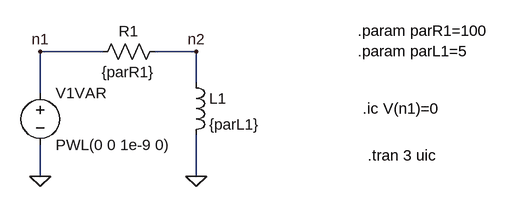
[diagram p0: schematic Circuit.asc]
Circuit.asc, the LTspice schematic file:
Version 4
SHEET 1 892 680
WIRE 240 48 144 48
WIRE 384 48 320 48
WIRE 384 96 384 48
WIRE 144 112 144 48
WIRE 144 240 144 192
WIRE 384 240 384 176
FLAG 144 240 0
FLAG 384 240 0
FLAG 144 48 n1
FLAG 384 48 n2
SYMBOL voltage 144 96 R0
SYMATTR InstName V1VAR
SYMATTR Value PWL(0 0 1e-9 0)
SYMBOL res 336 32 R90
WINDOW 0 0 56 VBottom 2
WINDOW 3 32 56 VTop 2
SYMATTR InstName R1
SYMATTR Value {parR1}
SYMBOL ind 368 80 R0
SYMATTR InstName L1
SYMATTR Value {parL1}
TEXT 632 16 Left 2 !.param parR1=100\n.param parL1=5
TEXT 640 136 Left 2 !.ic V(n1)=0
TEXT 648 208 Left 2 !.tran 3 uic

The netlist it stands for:
* Circuit.asc
V1VAR n1 0 PWL(0 0 1e-9 0)
R1 n2 n1 {parR1}
L1 n2 0 {parL1}
.param parR1=100
.param parL1=5
.ic V(n1)=0
.tran 3 uic
.backanno
.end